# Altium schematic sheet smoothieboard-5driver_2.SchDoc
size 409 x 279 mm; Date: 9/15/2017 15:08:36; Organization: Altium Limited; Address1: L3, 12a Rodborough Rd; Address2: Frenchs Forest; Address3: NSW; Address4: Australia 2086; Origin: Eagle
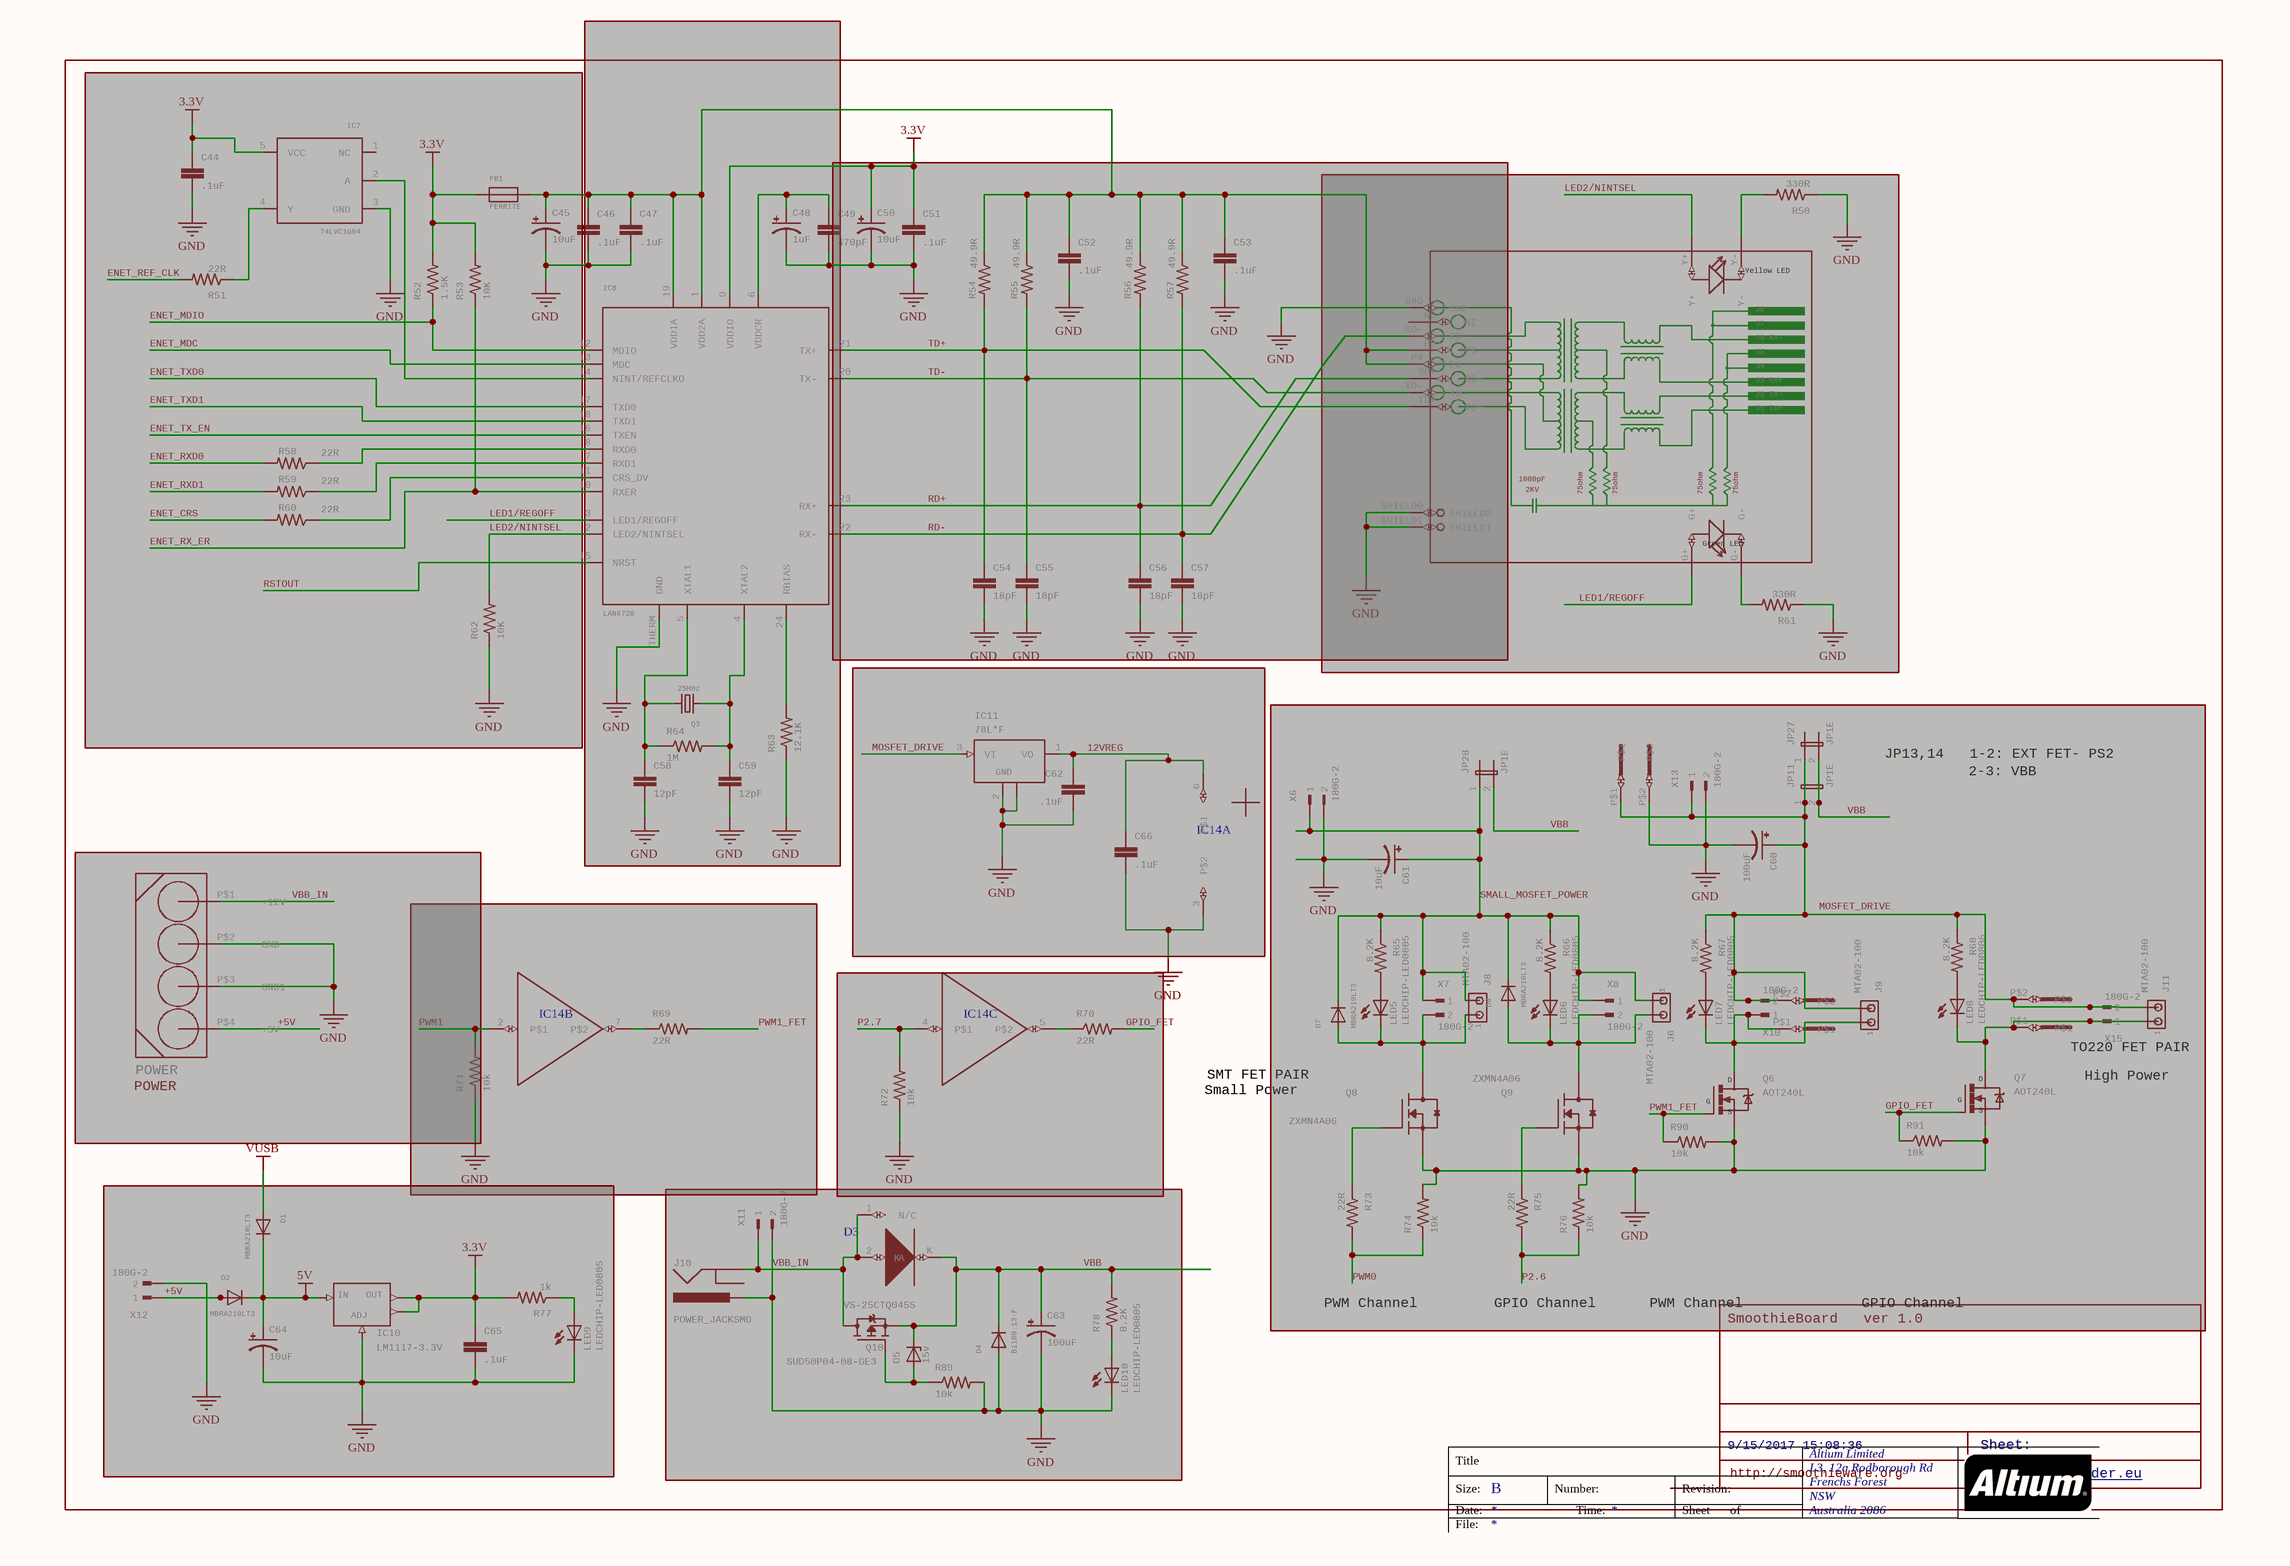
[diagram p0: smoothieboard-5driver_2.SchDoc]

## Parts
C44  .1uF  [C0603]
C45  10uF  [EIA3216]
C46  .1uF  [C0603]
C47  .1uF  [C0603]
C48  1uF  [EIA3216]
C49  470pF  [C0603K]
C50  10uF  [EIA3216]
C51  .1uF  [C0603]
C52  .1uF  [C0603]
C53  .1uF  [C0603]
C54  18pF  [C0603]
C55  18pF  [C0603]
C56  18pF  [C0603]
C57  18pF  [C0603]
C58  12pF  [C0603]
C59  12pF  [C0603]
C60  100uF  [PANASONIC_E]
C61  10uF  [EIA3216]
C62  .1uF  [C0603]
C63  100uF  [PANASONIC_E]
C64  10uF  [EIA3216]
C65  .1uF  [C0603]
C66  .1uF  [C0603]
D1  MBRA210LT3  [SMADIODE]
D2  MBRA210LT3  [SMADIODE]
D3  VS-25CTQ045S  [TO263AB]  (value not drawn)
D4  B1100-13-F  [SMADIODE]
D5  15v  [SMB]
D7  MBRA210LT3  [SMADIODE]
D8  MBRA210LT3  [SMADIODE]
FB1  FERRITE  [0603]
IC7  74LVC1G04  [SOT23-5]
IC8  LAN8720  [QFN24_4MM]
IC10  LM1117-3.3V  [SOT223]
IC11  78L*F  [SOT89]
IC14  TC4427  [SOIC8]  (value not drawn)  (parts A,B,C of 3)
J6  MTA02-100  [10X02MTA]
J8  MTA02-100  [10X02MTA]
J9  MTA02-100  [10X02MTA]
J10  POWER_JACKSMD  [POWER_JACK_SMD]
J11  MTA02-100  [10X02MTA]
JP11  JP1E  [JP1]
JP27  JP1E  [JP1]
JP28  JP1E  [JP1]
LED5  LEDCHIP-LED0805  [CHIP-LED0805]
LED6  LEDCHIP-LED0805  [CHIP-LED0805]
LED7  LEDCHIP-LED0805  [CHIP-LED0805]
LED8  LEDCHIP-LED0805  [CHIP-LED0805]
LED9  LEDCHIP-LED0805  [CHIP-LED0805]
LED10  LEDCHIP-LED0805  [CHIP-LED0805]
POWER  POWER  [MOLEX8981]
Q3  25MHz  [CRYSTAL_3.2X2.5]
Q6  AOT240L  [TO220BV]
Q7  AOT240L  [TO220BV]
Q8  ZXMN4A06  [SOT230P700X160-4N]
Q9  ZXMN4A06  [SOT230P700X160-4N]
Q10  SUD50P04-08-GE3  [TO252]
R50  330R  [R0603]
R51  22R  [R0603]
R52  1.5K  [R0603]
R53  10K  [R0603]
R54  49.9R  [R0603]
R55  49.9R  [R0603]
R56  49.9R  [R0603]
R57  49.9R  [R0603]
R58  22R  [R0603]
R59  22R  [R0603]
R60  22R  [R0603]
R61  330R  [R0603]
R62  10K  [R0603]
R63  12.1K  [R0603]
R64  1M  [R0603]
R65  8.2K  [R0603]
R66  8.2K  [R0603]
R67  8.2K  [R0603]
R68  8.2K  [R0603]
R69  22R  [R0603]
R70  22R  [R0603]
R71  10k  [R0603]
R72  10k  [R0603]
R73  22R  [R0603]
R74  10k  [R0603]
R75  22R  [R0603]
R76  10k  [R0603]
R77  1k  [R0603]
R78  8.2K  [R0603]
R89  10k  [R0603]
R90  10k  [R0603]
R91  10k  [R0603]
RJ1  J6RX-: J6 RX-  J3RX+: J3 RX+  J2TX-: J2 TX-  J1TX+: J1 TX+  YellowLED: Yellow LED  GreenLED: Green LED  [HR911105A]  (hidden comment: HR911105A)
U$5  5MMCONN  [1715250000]  (value not drawn)
U$6  5MMCONN  [1715250000]  (value not drawn)
U$10  5MMCONN  [1715250000]  (value not drawn)
X6  180G-2  [180G-2]
X7  180G-2  [180G-2]
X8  180G-2  [180G-2]
X10  180G-2  [180G-2]
X11  180G-2  [180G-2]
X12  180G-2  [180G-2]
X13  180G-2  [180G-2]
X15  180G-2  [180G-2]

## Blocks framed on the sheet
VS-25CTQ045S: C63 D3-D5 J10 LED10 Q10 R78 R89 X11

## Nets
3.3V: C44.1 C50.A(+) C51.1 C65.1 FB1.1(P$1) IC7.5(VCC) IC8.9(VDDIO) IC10.2(OUT) IC10.4(OUT) R52.2 R53.2 R77.2
5V: C64.A(+) D1.C D2.C IC10.3(IN)
VBB_IN: C44.2 C45.C(-) C46.2 C47.2 C48.C(-) C49.2 C50.C(-) C51.2 C52.2 C53.2 C54.2 C55.2 C56.2 C57.2 C58.2 C59.2 C60.- C61.C(-) C62.2 C63.- C64.C(-) C65.2 C66.2 D3.1(N/C) D3.2(A) D4.A IC7.3(GND) IC8.THERM(GND) IC10.1(ADJ) IC11.2(GND) IC11.2@1(GND) IC14.3(P$2) J10.P$4(GND) J10.VIN0(PWR) LED9.C LED10.C POWER.P$1(+12V) POWER.P$2(GND) POWER.P$3(GND1) Q6.S Q7.S Q8.3(S) Q9.3(S) Q10.3(D) R50.1 R61.1 R62.1 R63.1 R71.1 R72.1 R74.2 R76.2 R89.2 R90.2 R91.2 RJ1.GND RJ1.SHIELD0 RJ1.SHIELD1 U$5.P$2 X6.2 X11.1 X11.2 X12.2 X13.2  [also labelled GND]
VUSB: D1.A
12VREG: C62.1 C66.1 IC11.1(VO) IC14.6(P$1)
+5V: D2.A POWER.P$4(+5V) X12.1
ENET_CRS: R60.2
ENET_MDC: IC8.13(MDC)
ENET_MDIO: IC8.12(MDIO) R52.1
ENET_REF_CLK: R51.2
ENET_RX_ER: IC8.10(RXER) R53.1
ENET_RXD0: R58.2
ENET_RXD1: R59.2
ENET_TX_EN: IC8.16(TXEN)
ENET_TXD0: IC8.17(TXD0)
ENET_TXD1: IC8.18(TXD1)
GPIO_FET: Q7.G R70.2 R91.1
LED1/REGOFF: IC8.3(LED1/REGOFF) RJ1.G+
LED2/NINTSEL: IC8.2(LED2/NINTSEL) R62.2 RJ1.Y+
MOSFET_DRIVE: IC11.3(VI)
P2.6: R75.2 R76.1
P2.7: IC14.4(P$1) R72.2
PWM0: R73.2 R74.1
PWM1: IC14.2(P$1) R71.2
PWM1_FET: Q6.G R69.2 R90.1
RD+: C56.1 IC8.23(RX+) R56.2 RJ1.RD+
RD-: C57.1 IC8.22(RX-) R57.2 RJ1.RD-
RSTOUT: IC8.15(NRST)
SMALL_MOSFET_POWER: C61.A(+) D7.C D8.C J6.1 J8.2 JP28.1 R65.1 R66.1 X6.1 X7.1 X8.1
TD+: C54.1 IC8.21(TX+) R54.2 RJ1.TD+
TD-: C55.1 IC8.20(TX-) R55.2 RJ1.TD-
VBB: C63.+ D3.K D4.C D5.C JP11.2 JP27.2 JP28.2 Q10.2(S) R78.2
NetC45_A: C45.A(+) C46.1 C47.1 C52.1 C53.1 FB1.2(P$2) IC8.1(VDD2A) IC8.19(VDD1A) R54.1 R55.1 R56.1 R57.1 RJ1.P4 RJ1.P5
NetC48_A: C48.A(+) C49.1 IC8.6(VDDCR)
NetC58_1: C58.1 IC8.5(XTAL1) Q3.2 R64.1
NetC59_1: C59.1 IC8.4(XTAL2) Q3.1 R64.2
NetC60_+: C60.+ J9.2 J11.2 JP11.1 JP27.1 R67.1 R68.1 U$5.P$1 U$6.P$2 U$10.P$2 X10.2 X13.1 X15.2
NetD5_A: D5.A Q10.1(G) R89.1
NetD7_A: D7.A J8.1 LED5.C Q8.4(D) X7.2
NetD8_A: D8.A J6.2 LED6.C Q9.4(D) X8.2
NetIC7_2: IC7.2(A) IC8.14(NINT/REFCLKO)
NetIC7_4: IC7.4(Y) R51.1
NetIC8_7: IC8.7(RXD1) R59.1
NetIC8_8: IC8.8(RXD0) R58.1
NetIC8_11: IC8.11(CRS_DV) R60.1
NetIC8_24: IC8.24(RBIAS) R63.2
NetIC14_5: IC14.5(P$2) R70.1
NetIC14_7: IC14.7(P$2) R69.1
NetJ9_1: J9.1 LED7.C Q6.D U$10.P$1 X10.1
NetJ11_1: J11.1 LED8.C Q7.D U$6.P$1 X15.1
NetLED5_A: LED5.A R65.2
NetLED6_A: LED6.A R66.2
NetLED7_A: LED7.A R67.2
NetLED8_A: LED8.A R68.2
NetLED9_A: LED9.A R77.1
NetLED10_A: LED10.A R78.1
NetQ8_1: Q8.1(G) R73.1
NetQ9_1: Q9.1(G) R75.1
NetR50_2: R50.2 RJ1.Y-
NetR61_2: R61.2 RJ1.G-

Not connected (* = marked no-connect by the designer): IC7 1(NC); J10 GND(GNDBREAK); RJ1 NC

## Notes on the sheet
- JP13,14   1-2: EXT FET- PS2
- 2-3: VBB
- Small Power
- SMT FET PAIR
- TO220 FET PAIR
- High Power
- PWM Channel
- GPIO Channel
- SmoothieBoard   ver 1.0
- 9/15/2017 15:08:36
- Sheet:
- http://smoothieware.org
- www.microbuilder.eu <http://www.microbuilder.eu>
- Labels drawn without touching a wire or pin: MOSFET_DRIVE
- Title
- Size:
- Date:
- B
- Number:
- Time:
- Revision:
- Sheet
- of
- File:

## Library data of the parts
C44 C46 C47 C51-C59 C62 C65 C66 = C-EUC0603: CAPACITOR, European symbol; GateName_1: G$1; SymbolName_1: C-EU; DeviceName: C0603; LibraryName: resistor; DeviceSetName: C-EU
C45 C48 C50 C61 C64 = CAP_POL1206: Capacitor PolarizedThese are standard SMD and PTH capacitors. Normally 10uF, 47uF, and 100uF in electrolytic and tantalum varieties. Always verify the external diameter of the through hole cap, it varies with capacity, voltage, and manufacturer. The EIA devices should be standard.; GateName_1: G$1; DeviceName: 1206; SymbolName_1: CAP_POL; LibraryName: SparkFun; DeviceSetName: CAP_POL
C49 = C-EUC0603K: CAPACITOR, European symbol; GateName_1: G$1; SymbolName_1: C-EU; DeviceName: C0603K; LibraryName: resistor; DeviceSetName: C-EU
C60 C63 = CAP_POLE: Capacitor PolarizedThese are standard SMD and PTH capacitors. Normally 10uF, 47uF, and 100uF in electrolytic and tantalum varieties. Always verify the external diameter of the through hole cap, it varies with capacity, voltage, and manufacturer. The EIA devices should be standard.; GateName_1: G$1; DeviceName: E; SymbolName_1: CAP_POL; DeviceSetName: CAP_POL
  C60: LibraryName: SparkFun
  C63: LibraryName: SparkFun-Capacitors
D1 D2 D4 D7 D8 = DIODESMA: Diode   SMADIODE - SMA Surface Mount Package  20V 1A Schottky Diode Digikey (500mV @ 1A, 500uA Vr @ 20V): 641-1014-6-ND  10V 2A Schottky Diode Digikey (350mV @ 2A, 700uA Vr @ 10V): MBRA210LT3    SOD-123 30V 200mA (800mV Vf, 2uA Vr @ 25V) Schottky Diode (very fast switching for boost, etc.) - Digikey: BAT54T1GOSTR-ND  30V 500mA (430mV Vf, 130uA Vr @ 30V) Schottky Diode - Digikey: B0530W-FDICT-ND  MBR120 1A 20V (0.34Vf) Schottky Diode - Digikey: MBR120VLSFT1GOSCT-ND    SOD-323 10V 570mA (380mV Vf, 3ns) Schottky Diode - Digikey: ZLLS410CT-ND  1N4148WS - 75V 150mA (1V Vf @ 10mA, 4ns) Simple Diode - Digikey: 1N4148WSFSCT-ND, Mouser: 512-1N4148WS    SOD-523 BAT54 30V 200mA Schottky (0.8 Vf @ 100mA, 5ns) - Digikey: BAT54XV2CT-ND  30V 30mA Schottky Diode (RB751S-40TE61) - Digikey: RB751S-40TE61CT-ND    SOT23-R/W - SOT23 Package (R = Solder Paste/Reflow Ovens, W = Hand-Soldering)  BAT54Film 40V 300mA - Digikey: 497-7162-1-ND    DO-1N4148 Through Hole Small Current Diode (any model); GateName_1: G$1; SymbolName_1: DIODE; DeviceName: SMA; LibraryName: microbuilder; DeviceSetName: DIODE
D3 = ETH1506S: ETH1506S     Package : TO-263AB (D2PAK), TO-262AA  IF(AV) : 15 A VR : 600 V Hyperfast Rectifier, 15 A FRED Pt Diode variation Single die; GateName_1: G$1; SymbolName_1: ETH1506S; LibraryName: Geos; DeviceSetName: ETH1506S
D5 = ZENER-DIODESMB: Z-Diode; GateName_1: G$1; SymbolName_1: ZD; DeviceName: SMB; LibraryName: diode; DeviceSetName: ZENER-DIODE
FB1 = FERRITE: Ferrite Bead   0603 MMZ1608B121C - 120 Ohm, 600mA Ferrite Chip - Digikey: 445-2164-1-ND  BK1608HW121-T - 120 Ohm, 600mA Ferrite Chip - Digikey: 587-1876-2-ND; GateName_1: G$1; SymbolName_1: FERRITE; LibraryName: microbuilder; DeviceSetName: FERRITE
IC7 = 74LVC1G04: 74LVC1G04 - Single Inverter Gate    SOT23-5 SN74LVC1G04DBVR - Digikey: 296-11599-1-ND; GateName_1: G$1; SymbolName_1: 74LVC1G04; LibraryName: microbuilder; DeviceSetName: 74LVC1G04
IC8 = LAN8720: LAN8720A 10/100 Ethernet PHY   Mouser: 886-LAN8720AI-CP; GateName_1: G$1; SymbolName_1: LAN8720; LibraryName: microbuilder; DeviceSetName: LAN8720
IC10 = V_REG_LM1117SOT223: Voltage Regulator LM1117Standard adjustable voltage regulator but in SMD form. Spark Fun Electronics SKU : COM-00595; GateName_1: G$1; SymbolName_1: 78ADJ; DeviceName: SOT223; LibraryName: SparkFun; DeviceSetName: V_REG_LM1117; ADJ: ADJ; IN: IN; OUT: OUT
IC11 = 78L*F: POSITOIV-VOLTAGE REGULATORS   Output up to 100 mASource: http://focus.ti.com/lit/ds/symlink/ua78l05.pdf; GateName_1: G$1; SymbolName_1: 78XX2GND; DeviceName: F; DeviceSetName: 78L*; LibraryName: linear; GND: GND
IC14 = TC4427: GateName_1: RAILS; GateName_2: A; SymbolName_2: BUFFER; GateName_3: B; SymbolName_1: RAILS; SymbolName_3: BUFFER; LibraryName: custom_esorensen; DeviceSetName: TC4427
J6 J8 J9 J11 = MTA02-100: AMP connector; GateName_1: G$1; SymbolName_1: MTA-1_2; LibraryName: con-amp; DeviceSetName: MTA02-100; 1: 1
J10 = POWER_JACKSMD: Power JackThis is the standard 5.5mm barrel jack for power. The PTH is the most common, proven, reliable, footprint. All others are experimental. The Slot footprint only works if the mill layer is transmitted to the PCB fab house so be warned. Spark Fun Electronics SKU : PRT-00119. Mating wall wart : TOL-00298 (and others); GateName_1: G$1; DeviceName: SMD; SymbolName_1: POWERJACK; LibraryName: SparkFun; DeviceSetName: POWER_JACK
JP11 JP27 JP28 = JP1E: JUMPER; GateName_1: A; SymbolName_1: JP2E; LibraryName: jumper; DeviceSetName: JP1E
LED5-LED10 = LEDCHIP-LED0805: LED   OSRAM: - CHIPLED LG R971, LG N971, LY N971, LG Q971, LY Q971, LO R971, LY R971 LH N974, LH R974 LS Q976, LO Q976, LY Q976 LO Q996 - Hyper CHIPLED LW Q18S LB Q993, LB Q99A, LB R99A - SideLED LS A670, LO A670, LY A670, LG A670, LP A670 LB A673, LV A673, LT A673, LW A673 LH A674 LY A675 LS A676, LA A676, LO A676, LY A676, LW A676 LS A679, LY A679, LG A679 -  Hyper Micro SIDELEDÂ® LS Y876, LA Y876, LO Y876, LY Y876 LT Y87S - SmartLED LW L88C, LW L88S LB L89C, LB L89S, LG L890 LS L89K, LO L89K, LY L89K LS L896, LA L896, LO L896, LY L896 - TOPLED LS T670, LO T670, LY T670, LG T670, LP T670 LSG T670, LSP T670, LSY T670, LOP T670, LYG T670 LG T671, LOG T671, LSG T671 LB T673, LV T673, LT T673, LW T673 LH T674 LS T676, LA T676, LO T676, LY T676, LB T676, LH T676, LSB T676, LW T676 LB T67C, LV T67C, LT T67C, LS T67K, LO T67K, LY T67K, LW E67C LS E67B, LA E67B, LO E67B, LY E67B, LB E67C, LV E67C, LT E67C LW T67C LS T679, LY T679, LG T679 LS T770, LO T770, LY T770, LG T770, LP T770 LB T773, LV T773, LT T773, LW T773 LH T774 LS E675, LA E675, LY E675, LS T675 LS T776, LA T776, LO T776, LY T776, LB T776 LHGB T686 LT T68C, LB T68C - Hyper Mini TOPLEDÂ® LB M676 - Mini TOPLED SantanaÂ® LG M470 LS M47K, LO M47K, LY M47K    Source: http://www.osram.convergy.de   LUXEON: - LUMILEDÂ® LXK2-PW12-R00, LXK2-PW12-S00, LXK2-PW14-U00, LXK2-PW14-V00 LXK2-PM12-R00, LXK2-PM12-S00, LXK2-PM14-U00 LXK2-PE12-Q00, LXK2-PE12-R00, LXK2-PE12-S00, LXK2-PE14-T00, LXK2-PE14-U00 LXK2-PB12-K00, LXK2-PB12-L00, LXK2-PB12-M00, LXK2-PB14-N00, LXK2-PB14-P00, LXK2-PB14-Q00 LXK2-PR12-L00, LXK2-PR12-M00, LXK2-PR14-Q00, LXK2-PR14-R00 LXK2-PD12-Q00, LXK2-PD12-R00, LXK2-PD12-S00 LXK2-PH12-R00, LXK2-PH12-S00 LXK2-PL12-P00, LXK2-PL12-Q00, LXK2-PL12-R00    Source: www.luxeon.com   KINGBRIGHT:   KA-3528ASYC Source: www.kingbright.com; GateName_1: G$1; SymbolName_1: LED; DeviceName: CHIP-LED0805; LibraryName: led; DeviceSetName: LED
POWER = HDD-ATX_CON: ATX HDD Connector 4 pin Molex8981 Connector; GateName_1: G$1; SymbolName_1: ATX_HDD; J: ATX-HDD; LibraryName: Geos; DeviceSetName: HDD-ATX_CON
Q3 = CRYSTALTHIN: Crystals   HC49UP - Surface Mount Crystal  4.0MHz 18pF +/-30ppm Surface Mount Crystal [Digikey: 535-9857-1-ND]  12.0 MHz Surface Mount Crystal [Digikey: 535-9869-6-ND]  25.0 MHz Surface Mount Crystal [Digikey: 535-9078-1-ND]       3.2 x 2.5mm - MEMs SMT Crystal  12.0 MHz 8pF 15ppm 3.2 x 2.5mm Crystal [Digikey: -10-70Â°C: 644-1047-1-ND -40-125Â°C: 644-1128-1-ND]  16.0 MHz 8pF 15ppm 3.2 x 2.5mm Crystal [Digikey: -10-70Â°C: 644-1049-1-ND -40-125Â°C: 644-1129-2-ND]  16.0 MHz 10pF 10ppm 3.2 x 2.5mm Crystal [Digikey: 644-1100-1-ND]  27.12 MHz 18pF 30ppm 3.2 x 2.5mm Crystal [Digikey: 887-1424-1-ND]  27.12MHz 10pF 10ppm 3.2 x 2.5mm Crystal [Digikey: 887-1329-1-ND]       4.9 x 1.8mm - MEMs SMT Crystal  32.768 KHz 12.5pF 20ppm 4.9 x 1.8mm Crystal [Digikey: SE2415CT-ND]       Cylinder 32.768KHz Cylinder Crystal; GateName_1: G$1; DeviceName: THIN; SymbolName_1: CRYSTAL; LibraryName: microbuilder; DeviceSetName: CRYSTAL
Q6 Q7 = IRF540: HEXFET Power MOSFET; GateName_1: G$1; SymbolName_1: MFNS; LibraryName: transistor-power; DeviceSetName: IRF540; D: D; S: S; G: G
Q8 Q9 = MOSFET-NCH_SOT-223: GateName_1: G$1; SymbolName_1: MOSFET-NCH; DeviceName: SOT-223; LibraryName: ipc-7351-transistor; DeviceSetName: MOSFET-NCH_
Q10 = SPD30P06PTO252: SIPMOS(R) Power-Transistor P-Channel, Enhancement mode   Source: http://www.infineon.com/upload/Document/cmc_upload/documents/012/3615/SPD_U30P06P.pdf; GateName_1: G$1; SymbolName_1: P-MOSFET; DeviceName: TO252; LibraryName: transistor-fet; DeviceSetName: SPD30P06P
R50-R78 R89-R91 = R-US_R0603: RESISTOR, American symbol; GateName_1: G$1; SymbolName_1: R-US; DeviceSetName: R-US_; DeviceName: R0603; LibraryName: resistor
RJ1 = HR911105A: SOC006; GateName_1: G$1; SymbolName_1: HR911105A; LibraryName: Itead_BP_110825.lbr; DeviceSetName: HR911105A; J8: J8; J7: J7; J5: J5; J4: J4; 75ohm: 75ohm; 1000pF: 1000pF; 2KV: 2KV
U$5 U$6 U$10 = 5MMCONN: GateName_1: G$1; SymbolName_1: JUMPER; LibraryName: eric_sorensen; DeviceSetName: 5MMCONN
X6-X8 X10-X13 X15 = 180G-2: WEIDMUELLER CLAMP CONNECTOR; GateName_1: G$1; SymbolName_1: MALE-2; LibraryName: con-weidmueller-sl35; DeviceSetName: 180G-2; MF: MF; MPN: MPN; OC_FARNELL: unknown; OC_NEWARK: unknown